# EAGLE schematic 5V LINEAR REGULATOR BREAKOUT V00 (EAGLE 9.3.0)
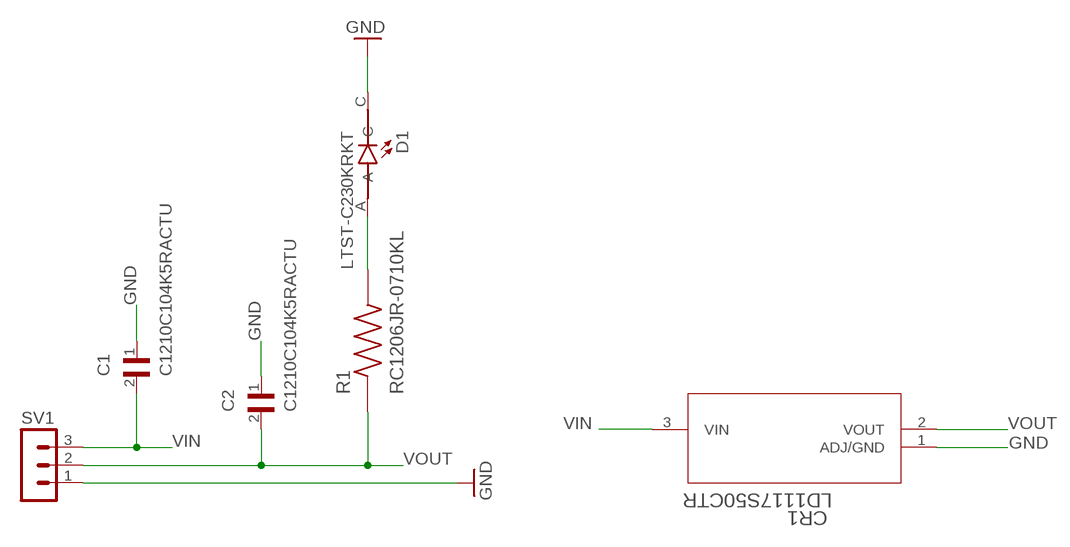
[diagram p0: schematic, sheet 1]

## Parts
C1  C1210C104K5RACTU  [CAPC3225X280]
C2  C1210C104K5RACTU  [CAPC3225X280]
CR1  LD1117S50CTR  [SOT-223_STM]
D1  LTST-C230KRKT  [LEDC3216X110]
R1  RC1206JR-0710KL  [RESC3116X65N]
SV1  MA03-1  [MA03-1]

## Nets
GND: C1.1 C2.1 CR1.1(ADJ/GND) D1.C SV1.1
N$1: D1.A R1.2
VIN: C1.2 CR1.3(VIN) SV1.3
VOUT: C2.2 CR1.2(VOUT) R1.1 SV1.2

## Library data of the parts
C1 C2 = C1210C104K5RACTU:C1210C104K5RACTU: KEMET C1210C104K5RACTU / CAPACITOR .1UF 50V 1210 CERAMI; DESCRIPTION: 0.1µF ±10% 50V Ceramic Capacitor X7R 1210 _3225 Metric_; DIGI-KEY_PART_NUMBER: 399-1267-1-ND; DIGI-KEY_PURCHASE_URL: https://www.digikey.com/product-detail/en/kemet/C1210C104K5RACTU/399-1267-1-ND/411542?utm_source=snapeda&utm_medium=aggregator&utm_campaign=symbol; MF: KEMET; MP: C1210C104K5RACTU; PACKAGE: 1210 KEMET
CR1 = LD1117S50CTR:LD1117S50CTR: IC REG LINEAR 5V 800MA SOT223; BUILT_BY: EMA_UL_Team; MANUFACTURER_PART_NUMBER: LD1117S50CTR; SOURCELIBRARY: Updates_to_database_2020-11-13; VENDOR: STMicroelectronics
D1 = LTST-C230KRKT:LTST-C230KRKT: LED SMT RED CLR 1206 TAPE; DESCRIPTION: Red 631nm LED Indication - Discrete 2V 1206 _3216 Metric_; DIGI-KEY_PART_NUMBER: 160-1457-1-ND; DIGI-KEY_PURCHASE_URL: https://www.digikey.com/product-detail/en/lite-on-inc/LTST-C230KRKT/160-1457-1-ND/386856?utm_source=snapeda&utm_medium=aggregator&utm_campaign=symbol; MF: Lite-On Inc.; MP: LTST-C230KRKT; PACKAGE: 1206 Lite-On
R1 = RC1206JR-0710KL:RC1206JR-0710KL: Res Thick Film 1206 10K Ohm 5% 0.25W(1/4W) ±100ppm/C Epoxy Pad SMD T/R; DESCRIPTION: 10 kOhms ±5% 0.25W, 1/4W Chip Resistor 1206 _3216 Metric_ Moisture Resistant Thick Film; DIGI-KEY_PART_NUMBER: 311-10KERCT-ND; DIGI-KEY_PURCHASE_URL: https://www.digikey.com/product-detail/en/yageo/RC1206JR-0710KL/311-10KERCT-ND/732156?utm_source=snapeda&utm_medium=aggregator&utm_campaign=symbol; MF: Yageo; MP: RC1206JR-0710KL; PACKAGE: 3116 Yageo
SV1 = con-lstb:MA03-1: PIN HEADER; OC_FARNELL: unknown; OC_NEWARK: unknown